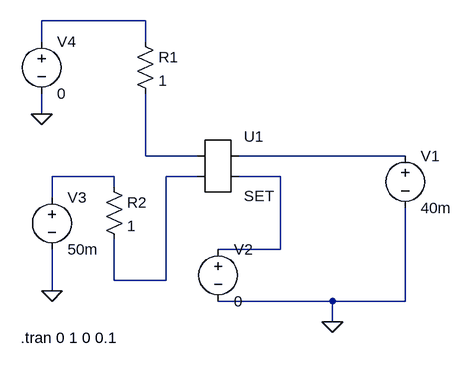
[diagram p0: schematic Draft1.asc]
Draft1.asc, the LTspice schematic file:
Version 4
SHEET 1 880 680
WIRE 96 -112 -64 -112
WIRE -64 -80 -64 -112
WIRE 96 -80 96 -112
WIRE -64 32 -64 0
WIRE 96 96 96 0
WIRE 176 96 96 96
WIRE 496 96 240 96
WIRE 48 128 -48 128
WIRE 176 128 128 128
WIRE 304 128 240 128
WIRE 48 144 48 128
WIRE -48 160 -48 128
WIRE 304 240 304 128
WIRE 304 240 208 240
WIRE 48 288 48 224
WIRE 128 288 128 128
WIRE 128 288 48 288
WIRE -48 304 -48 240
WIRE 384 320 208 320
WIRE 496 320 496 176
WIRE 496 320 384 320
WIRE 384 352 384 320
FLAG 384 352 0
FLAG -48 304 0
FLAG -64 32 0
SYMBOL voltage 496 80 R0
WINDOW 123 0 0 Left 0
WINDOW 39 0 0 Left 0
SYMATTR InstName V1
SYMATTR Value 40m
SYMBOL voltage 208 224 R0
WINDOW 123 0 0 Left 0
WINDOW 39 0 0 Left 0
SYMATTR InstName V2
SYMATTR Value 0
SYMBOL voltage -48 144 R0
WINDOW 123 0 0 Left 0
WINDOW 39 0 0 Left 0
SYMATTR InstName V3
SYMATTR Value 50m
SYMBOL voltage -64 -96 R0
WINDOW 123 0 0 Left 0
WINDOW 39 0 0 Left 0
SYMATTR InstName V4
SYMATTR Value 0
SYMBOL res 80 -96 R0
SYMATTR InstName R1
SYMATTR Value 1
SYMBOL res 32 128 R0
SYMATTR InstName R2
SYMATTR Value 1
SYMBOL AutoGenerated\\SET 208 112 R0
SYMATTR InstName U1
TEXT -96 376 Left 2 !.tran 0 1 0 0.1

The netlist it stands for:
* Draft1.asc
V1 N003 0 40m
V2 N006 0 0
V3 N004 0 50m
V4 N001 0 0
R1 N001 N002 1
R2 N004 N005 1
* U1: SET (symbol AutoGenerated\SET not available, pins judged from their places): pin1=N002 pin2=N005 pin3=N003 pin4=N006
.tran 0 1 0 0.1
.backanno
.end